# Altium project datapool_8810.PrjPcb (part 1 of 2)
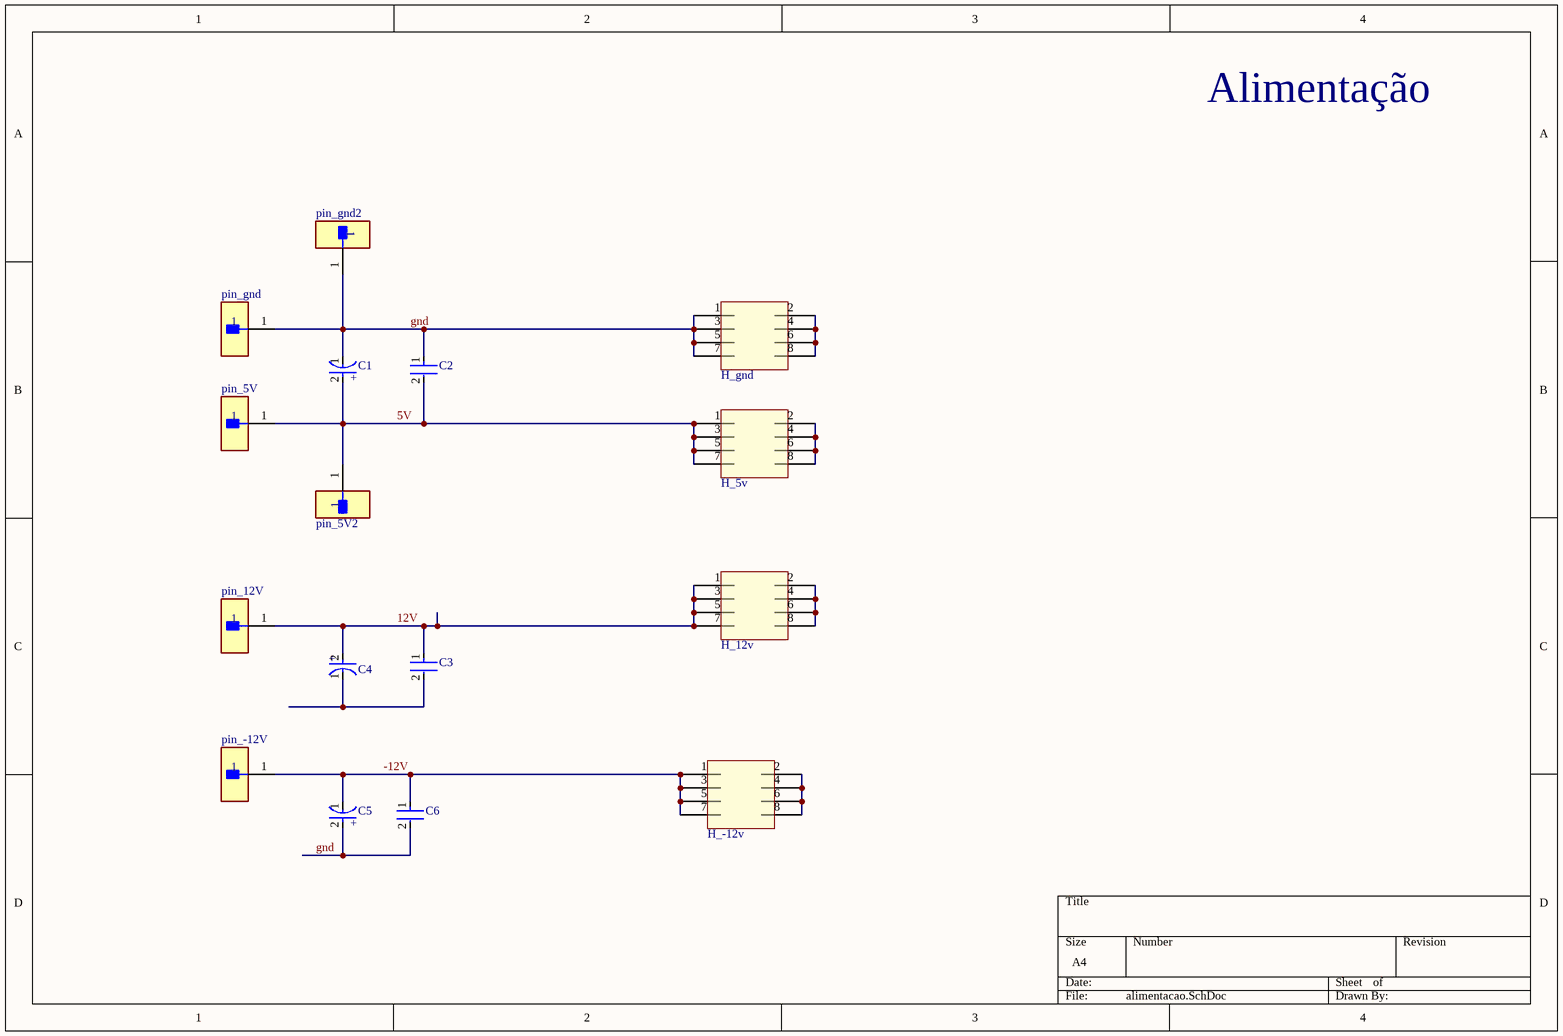
[diagram p0: alimentacao.SchDoc]
7 sheets, 294 parts. Net scope: global (net labels, ports and power ports of the same name join across sheets).
Board file: 8810.PcbDoc
Sheets:
  alimentacao.SchDoc
  protoboard.SchDoc
  leds.SchDoc
  chaves.SchDoc
  clock.SchDoc
  probe.SchDoc
  8810.SchDoc

## Sheet alimentacao.SchDoc
size A4; SheetNumber: 1; SheetTotal: 7

### Parts
(Parts that share a designator on the sheet are numbered #1, #2 ... from top to bottom, then left to right.)
C1#1  EEU-FM1H101BJ  [FP-FM8-MFG]  (value not drawn)
C2#1  RCER71H335K3K1H03B  [FP-RCE3M1-MFG]  (value not drawn)
C3#1  RCER71H335K3K1H03B  [FP-RCE3M1-MFG]  (value not drawn)
C4#1  EEU-FM1H101BJ  [FP-FM8-MFG]  (value not drawn)
C5#1  EEU-FM1H101BJ  [FP-FM8-MFG]  (value not drawn)
C6#1  RCER71H335K3K1H03B  [FP-RCE3M1-MFG]  (value not drawn)
H_5v  header 2x4  [header 2x4]  (value not drawn)
H_12v  header 2x4  [header 2x4]  (value not drawn)
H_-12v  header 2x4  [header 2x4]  (value not drawn)
H_gnd  header 2x4  [header 2x4]  (value not drawn)
pin_5V2#1  TSW-101-07-L-S  [FP-TSW-101-07-L-S-MFG]  (value not drawn)
pin_5V#1  TSW-101-07-L-S  [FP-TSW-101-07-L-S-MFG]  (value not drawn)
pin_12V#1  TSW-101-07-L-S  [FP-TSW-101-07-L-S-MFG]  (value not drawn)
pin_-12V#1  TSW-101-07-L-S  [FP-TSW-101-07-L-S-MFG]  (value not drawn)
pin_gnd2#1  TSW-101-07-L-S  [FP-TSW-101-07-L-S-MFG]  (value not drawn)
pin_gnd#1  TSW-101-07-L-S  [FP-TSW-101-07-L-S-MFG]  (value not drawn)

### Nets
5V: C1#1.2(A) C2#1.2 H_5v.1 H_5v.3 H_5v.5 H_5v.7 pin_5V2#1.1 pin_5V#1.1
12V: C3#1.1 C4#1.2(A) H_12v.1 H_12v.3 H_12v.5 H_12v.7 pin_12V#1.1
-12V: C5#1.1(C) C6#1.1 H_-12v.1 H_-12v.3 H_-12v.5 H_-12v.7 pin_-12V#1.1
gnd: C1#1.1(C) C2#1.1 C5#1.2(A) C6#1.2 H_gnd.1 H_gnd.3 H_gnd.5 H_gnd.7 pin_gnd2#1.1 pin_gnd#1.1
NetC3#1_2: C3#1.2 C4#1.1(C)
NetH_5v_2: H_5v.2 H_5v.4 H_5v.6 H_5v.8
NetH_12v_2: H_12v.2 H_12v.4 H_12v.6 H_12v.8
NetH_-12v_2: H_-12v.2 H_-12v.4 H_-12v.6 H_-12v.8
NetH_gnd_2: H_gnd.2 H_gnd.4 H_gnd.6 H_gnd.8

### Notes on the sheet
- Alimentação
- (in symbol CMP-05427-000021-1) +

### Library data of the parts
C1#1 C4#1 C5#1 = CMP-05427-000021-1: CAP ALUM 10uF 20% 50V RADIAL; Polarity: Polar; Impedance: 61mR; Ripple Current: 870mA; Life (Hours): 3000Hour; Dissipation Factor: 0.1%; Packaging: Ammo Pack; Voltage Rating (DC): 50V; Diameter: 8mm; Radiation Hardening: No; Max Operating Temperature: 105°C; Length: 11.5mm; Tolerance: 20%; Termination: Radial; Features: General Purpose; Case/Package: Radial; Voltage Rating: 50V; Min Operating Temperature: -40°C; Height - Seated (Max): 0.512inch; Mount: Through Hole; Series: FM; Height: 11.5mm; Capacitance: 10uF; ESR (Equivalent Series Resistance): 61mR; Lead Free: Lead Free; Lead Pitch: 0.197inch; Package Quantity: 1000
C2#1 C3#1 C6#1 = CMP-06035-028451-1: Cap Ceramic 100nF 50V X7R ±10% Radial 5mm +125°C Automotive Ammo Pack; Lead Diameter: 0.5mm; Lead/Base Style: Formed Leads; Height: 5mm; Ratings: AEC-Q200; Capacitance: 100nF; Package Quantity: 500; Length: 0.217inch; Min Operating Temperature: -55°C; Voltage Rating (DC): 50V; Dielectric: X7R; Case/Package: Radial; Height - Seated (Max): 0.197inch; Termination: Radial; Mount: Through Hole; Max Operating Temperature: 125°C; Width: 0.157inch; Voltage Rating: 50V; Packaging: Bulk; Resistor Type: Ceramic; Tolerance: 10%; Lead Pitch: 0.197inch
H_5v H_12v H_-12v H_gnd = header 2x4: header male 2x4; pin to pad: 1>C1 2>C2 3>C3 4>C4 5>C5 6>C6 7>C7 8>C8; Parameter 1: header 2x4
pin_5V2#1 pin_5V#1 pin_12V#1 pin_-12V#1 pin_gnd2#1 pin_gnd#1 = CMP-02766-001775-1: CONN HEADER VERT 1POS; Gender: Male; Number of Contacts: 1; Max Current Rating: 7.6A; Max Voltage Rating (AC): 550V; RoHS Compliant: Yes; Contact Finish - Mating: GOLD; Length: 2.54mm; Series: TSW; Insulation Material: PBT; Reach SVHC Compliant: Yes; Radiation Hardening: No; Contact Plating: Gold; Termination: Solder; Contact Type: Male Pin; Orientation: Straight; Number of Rows: 1; Depth: 2.54mm; Housing Material: Polyester; Lead Free: Lead Free; Fastening Type: Pull; Flammability Rating: UL94 V-0; Mount: Through Hole; Housing Color: Black; Contact Shape: Square; Min Operating Temperature: -55°C; Connector Type: Header; Contact Mating Length: 0.23inch; Width: 2.54mm; Packaging: Bulk; Contact Material: Bronze; Max Operating Temperature: 125°C; Number of Positions: 1; Color: Black; Insulation Color: Black

## Sheet protoboard.SchDoc
size A4; SheetNumber: 2; SheetTotal: 7
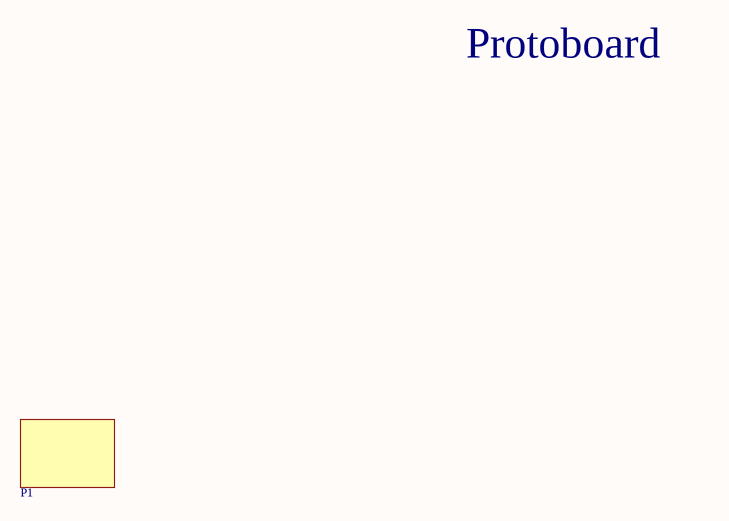
[diagram p1: protoboard.SchDoc]

### Parts
P1  2 protoboard 830 pin  [PCBComponent_1]  (value not drawn)

### Notes on the sheet
- Protoboard

### Library data of the parts
P1 = protoboard: 2 protoboard 830 pin  each; Parameter 1: 2X830 pin

## Sheet leds.SchDoc
size A3 portrait; SheetNumber: 2; SheetTotal: 6
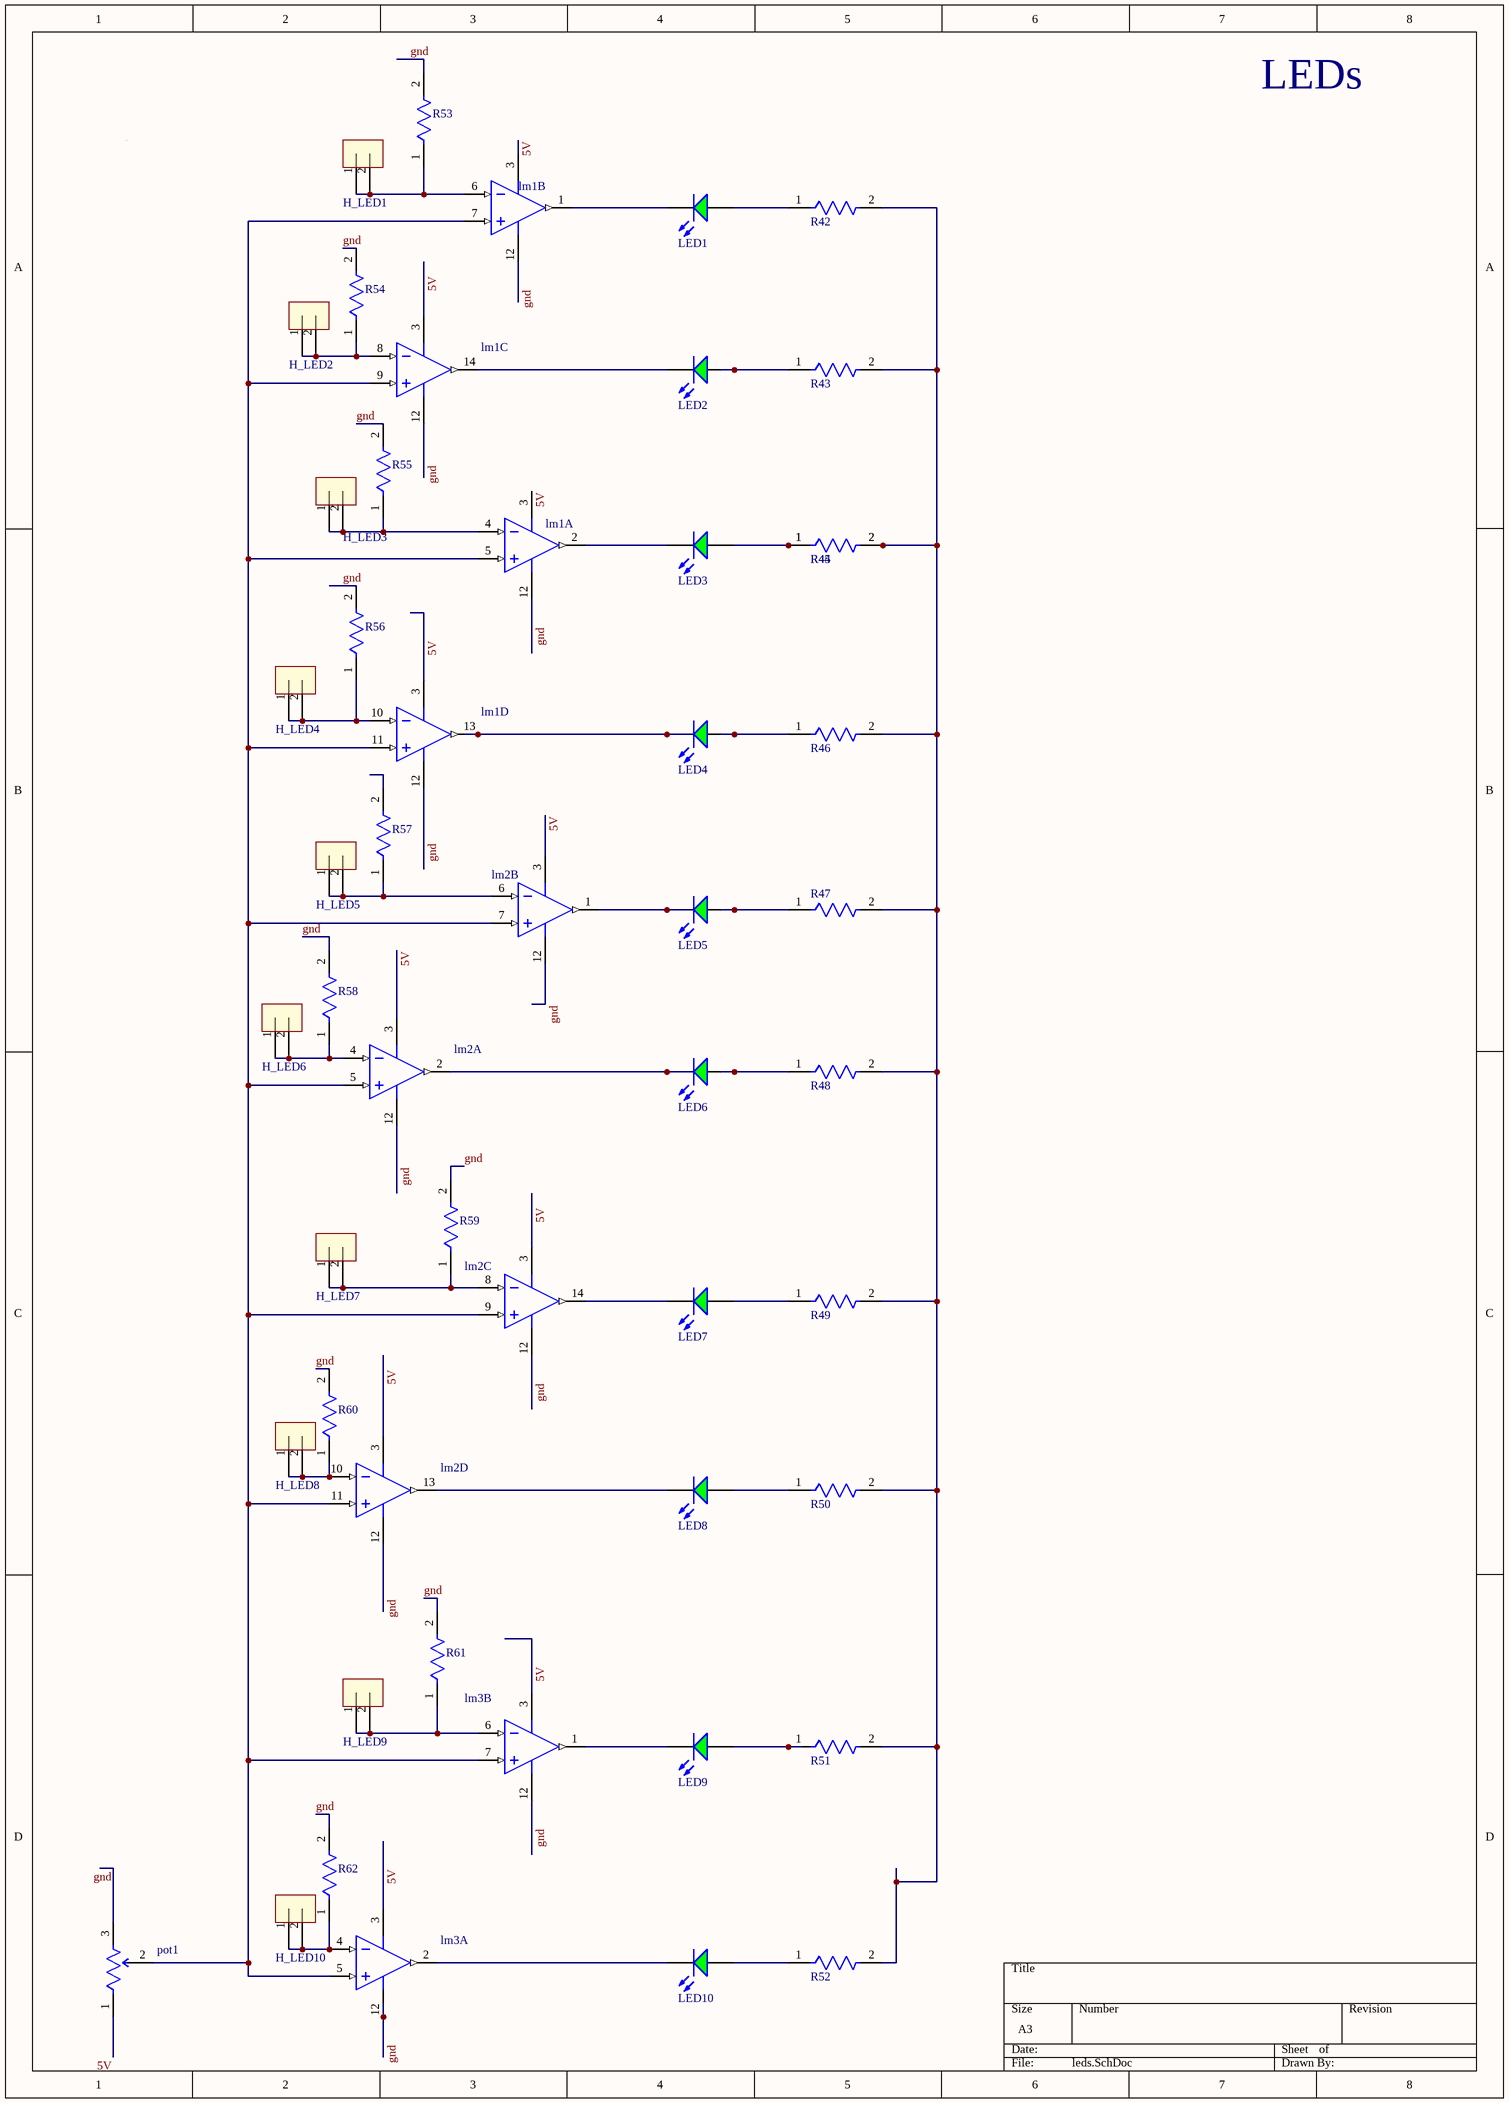
[diagram p2: leds.SchDoc]

### Parts
(Parts that share a designator on the sheet are numbered #1, #2 ... from top to bottom, then left to right.)
H_LED1  header 2x1  [header 2x1]  (value not drawn)
H_LED2  header 2x1  [header 2x1]  (value not drawn)
H_LED3  header 2x1  [header 2x1]  (value not drawn)
H_LED4  header 2x1  [header 2x1]  (value not drawn)
H_LED5  header 2x1  [header 2x1]  (value not drawn)
H_LED6  header 2x1  [header 2x1]  (value not drawn)
H_LED7  header 2x1  [header 2x1]  (value not drawn)
H_LED8  header 2x1  [header 2x1]  (value not drawn)
H_LED9  header 2x1  [header 2x1]  (value not drawn)
H_LED10  header 2x1  [header 2x1]  (value not drawn)
LED1#1  WP7113SGD  [KING-WP7113SGD_V]  (value not drawn)
LED2#1  WP7113SGD  [KING-WP7113SGD_V]  (value not drawn)
LED3#1  WP7113SGD  [KING-WP7113SGD_V]  (value not drawn)
LED4#1  WP7113SGD  [KING-WP7113SGD_V]  (value not drawn)
LED5#1  WP7113SGD  [KING-WP7113SGD_V]  (value not drawn)
LED6#1  WP7113SGD  [KING-WP7113SGD_V]  (value not drawn)
LED7#1  WP7113SGD  [KING-WP7113SGD_V]  (value not drawn)
LED8#1  WP7113SGD  [KING-WP7113SGD_V]  (value not drawn)
LED9#1  WP7113SGD  [KING-WP7113SGD_V]  (value not drawn)
LED10#1  WP7113SGD  [KING-WP7113SGD_V]  (value not drawn)
lm1#1  LM339J  [J0014A]  (value not drawn)  (parts A,B,C,D of 4)
lm2#1  LM339J  [J0014A]  (value not drawn)  (parts A,B,C,D of 4)
lm3#1  LM339J  [J0014A]  (value not drawn)  (parts A,B of 4)
pot1#1  3296W-1-501LF  [FP-3296W-MFG]  (value not drawn)
R42#1  MRS16000C2002FCT00  [FP-MRS1600-MFG]  (value not drawn)
R43#1  MRS16000C2002FCT00  [FP-MRS1600-MFG]  (value not drawn)
R44#1  MRS16000C2002FCT00  [FP-MRS1600-MFG]  (value not drawn)
R45#1  MRS16000C2002FCT00  [FP-MRS1600-MFG]  (value not drawn)
R46#1  MRS16000C2002FCT00  [FP-MRS1600-MFG]  (value not drawn)
R47#1  MRS16000C2002FCT00  [FP-MRS1600-MFG]  (value not drawn)
R48#1  MRS16000C2002FCT00  [FP-MRS1600-MFG]  (value not drawn)
R49#1  MRS16000C2002FCT00  [FP-MRS1600-MFG]  (value not drawn)
R50#1  MRS16000C2002FCT00  [FP-MRS1600-MFG]  (value not drawn)
R51#1  MRS16000C2002FCT00  [FP-MRS1600-MFG]  (value not drawn)
R52#1  MRS16000C2002FCT00  [FP-MRS1600-MFG]  (value not drawn)
R53#1  MRS16000C2002FCT00  [FP-MRS1600-MFG]  (value not drawn)
R54#1  MRS16000C2002FCT00  [FP-MRS1600-MFG]  (value not drawn)
R55#1  MRS16000C2002FCT00  [FP-MRS1600-MFG]  (value not drawn)
R56#1  MRS16000C2002FCT00  [FP-MRS1600-MFG]  (value not drawn)
R57#1  MRS16000C2002FCT00  [FP-MRS1600-MFG]  (value not drawn)
R58#1  MRS16000C2002FCT00  [FP-MRS1600-MFG]  (value not drawn)
R59  MRS16000C2002FCT00  [FP-MRS1600-MFG]  (value not drawn)
R60  MRS16000C2002FCT00  [FP-MRS1600-MFG]  (value not drawn)
R61  MRS16000C2002FCT00  [FP-MRS1600-MFG]  (value not drawn)
R62  MRS16000C2002FCT00  [FP-MRS1600-MFG]  (value not drawn)

### Nets
5V: lm1#1.3(V+) lm2#1.3(V+) lm3#1.3(V+) pot1#1.1(CCW)
gnd: lm1#1.12(GND) lm2#1.12(GND) lm3#1.12(GND) pot1#1.3(CW) R53#1.2 R54#1.2 R55#1.2 R56#1.2 R58#1.2 R59.2 R60.2 R61.2 R62.2
NetH_LED1_1: H_LED1.1 H_LED1.2 lm1#1.6(IN2-) R53#1.1
NetH_LED2_1: H_LED2.1 H_LED2.2 lm1#1.8(IN3-) R54#1.1
NetH_LED3_1: H_LED3.1 H_LED3.2 lm1#1.4(IN1-) R55#1.1
NetH_LED4_1: H_LED4.1 H_LED4.2 lm1#1.10(IN4-) R56#1.1
NetH_LED5_1: H_LED5.1 H_LED5.2 lm2#1.6(IN2-) R57#1.1
NetH_LED6_1: H_LED6.1 H_LED6.2 lm2#1.4(IN1-) R58#1.1
NetH_LED7_1: H_LED7.1 H_LED7.2 lm2#1.8(IN3-) R59.1
NetH_LED8_1: H_LED8.1 H_LED8.2 lm2#1.10(IN4-) R60.1
NetH_LED9_1: H_LED9.1 H_LED9.2 lm3#1.6(IN2-) R61.1
NetH_LED10_1: H_LED10.1 H_LED10.2 lm3#1.4(IN1-) R62.1
NetLED1#1_1: LED1#1.1(A) R42#1.1
NetLED1#1_2: LED1#1.2(K) lm1#1.1(OUT2)
NetLED2#1_1: LED2#1.1(A) R43#1.1
NetLED2#1_2: LED2#1.2(K) lm1#1.14(OUT3)
NetLED3#1_1: LED3#1.1(A) R44#1.1 R45#1.1
NetLED3#1_2: LED3#1.2(K) lm1#1.2(OUT1)
NetLED4#1_1: LED4#1.1(A) R46#1.1
NetLED4#1_2: LED4#1.2(K) lm1#1.13(OUT4)
NetLED5#1_1: LED5#1.1(A) R47#1.1
NetLED5#1_2: LED5#1.2(K) lm2#1.1(OUT2)
NetLED6#1_1: LED6#1.1(A) R48#1.1
NetLED6#1_2: LED6#1.2(K) lm2#1.2(OUT1)
NetLED7#1_1: LED7#1.1(A) R49#1.1
NetLED7#1_2: LED7#1.2(K) lm2#1.14(OUT3)
NetLED8#1_1: LED8#1.1(A) R50#1.1
NetLED8#1_2: LED8#1.2(K) lm2#1.13(OUT4)
NetLED9#1_1: LED9#1.1(A) R51#1.1
NetLED9#1_2: LED9#1.2(K) lm3#1.1(OUT2)
NetLED10#1_1: LED10#1.1(A) R52#1.1
NetLED10#1_2: LED10#1.2(K) lm3#1.2(OUT1)
Netlm1#1_5: lm1#1.5(IN1+) lm1#1.7(IN2+) lm1#1.9(IN3+) lm1#1.11(IN4+) lm2#1.5(IN1+) lm2#1.7(IN2+) lm2#1.9(IN3+) lm2#1.11(IN4+) lm3#1.5(IN1+) lm3#1.7(IN2+) pot1#1.2(WIPER)
NetR42#1_2: R42#1.2 R43#1.2 R44#1.2 R45#1.2 R46#1.2 R47#1.2 R48#1.2 R49#1.2 R50#1.2 R51#1.2 R52#1.2

Not connected (* = marked no-connect by the designer): R57#1 2

### Notes on the sheet
- LEDs

### Library data of the parts
H_LED1-H_LED10 = Heade 1x2: header male 2 pin; pin to pad: 1>C1 2>C2; Parameter 1: H2x1; Parameter 2: *
LED1#1 LED2#1 LED3#1 LED4#1 LED5#1 LED6#1 LED7#1 LED8#1 LED9#1 LED10#1 = CMP-2100-03698-1: LED Green, 62.5 mW, 25 mA, -40 to 85 degC, 2-Pin THD, RoHS, Bulk; Manufacturer: Kingbright; Viewing Angle: 30degrees; Lens Style: Tinted; Test Current: 20mA; Forward Voltage: 2.2V; Wavelength: 568nm; Luminous Intensity: 40mcd; Package Reference: WP7113SGD; Colour: Green; Lead Free: LeadFree; Packaging: Bulk; RoHSCompliant: true; Package Quantity: 1000; Illumination Colour: Green; Case/Package: Radial; Datasheet URL: http://www.kingbrightusa.com/images/catalog/SPEC/WP7113SGD.pdf; Dominant Wavelength: 568nm; Datasheet Version: Rev. 6B, 01/2015; Package Description: 2-Pin Through Hole Device, Dia 5.9 mm, Body Length 8.6 mm; Height: 8.6mm
lm1#1 lm2#1 lm3#1 = CMP-0060-00012-3: Low Power Low Offset Voltage Quad Comparator, 14-pin CerDIP; Manufacturer: Texas Instruments; PowerWise: N; PackageTopMarking: NSUZXYYTT*LM339J; PackageDescription: Cerdip, .400 x .310in Body, 14 Lead, .300in Centers, .100in Pitch; ComponentLink1Description: Datasheet URL; PinCount: 14; PackageReference: J0014A; ComponentLink1URL: http://www.ti.com/general/docs/lit/getliterature.tsp?genericPartNumber=LM339-N&fileType=pdf; CompType: Comparator; RoHS: N
pot1#1 = CMP-07234-000046-1: TRIMMER 500 OHM 0.5W PC PIN TOP; Resistance: 10kR; Temperature Coefficient: 100ppm/°C; Resistance Tolerance: 10%; Number of Turns: 25; Max Power Dissipation: 500mW; Packaging: Rail/Tube; Color: Blue; Technology: CERMET; Max Operating Temperature: 125°C; RoHS Compliant: Yes; Radiation Hardening: No; Series: 3296; Military Standard: Not; Width: 9.53mm; Weight: 0.03oz; Length: 9.53mm; Package Quantity: 50; Height: 0.395inch; Min Operating Temperature: -55°C; Lead Free: Lead Free; Mount: Through Hole; Depth: 4.83mm; Termination: Pin; Taper: Linear; Contact Plating: Tin; Resistor Type: Cermet; Tolerance: 10%; REACH SVHC: No SVHC; Power Rating: 500mW
R42#1 R43#1 R44#1 R45#1 R46#1 R47#1 R48#1 R49#1 R50#1 R51#1 R52#1 R53#1 R54#1 R55#1 R56#1 R57#1 R58#1 R59-R62 = CMP-02408-000019-1: RES 20K OHM 0.4W 1% AXIAL; Max Power Dissipation: 400mW; Temperature Coefficient: 50ppm/°C; Resistance: 20kR; Technology: THIN FILM; Max Operating Temperature: 155°C; Number of Terminations: 2; RoHS Compliant: Yes; Packaging: Tape and Reel; Radiation Hardening: No; Contact Plating: Tin; Military Standard: Not; Construction: Cylindrical; Diameter: 1.6mm; Tolerance: 1%; Mount: Through Hole; Power Rating: 400mW; Case/Package: Conformal; Termination: Axial; Length: 3.6mm; Min Operating Temperature: -55°C; Resistor Type: Metal Film; Series: MRS16

## Sheet chaves.SchDoc
size A3 portrait; SheetNumber: 3; SheetTotal: 6
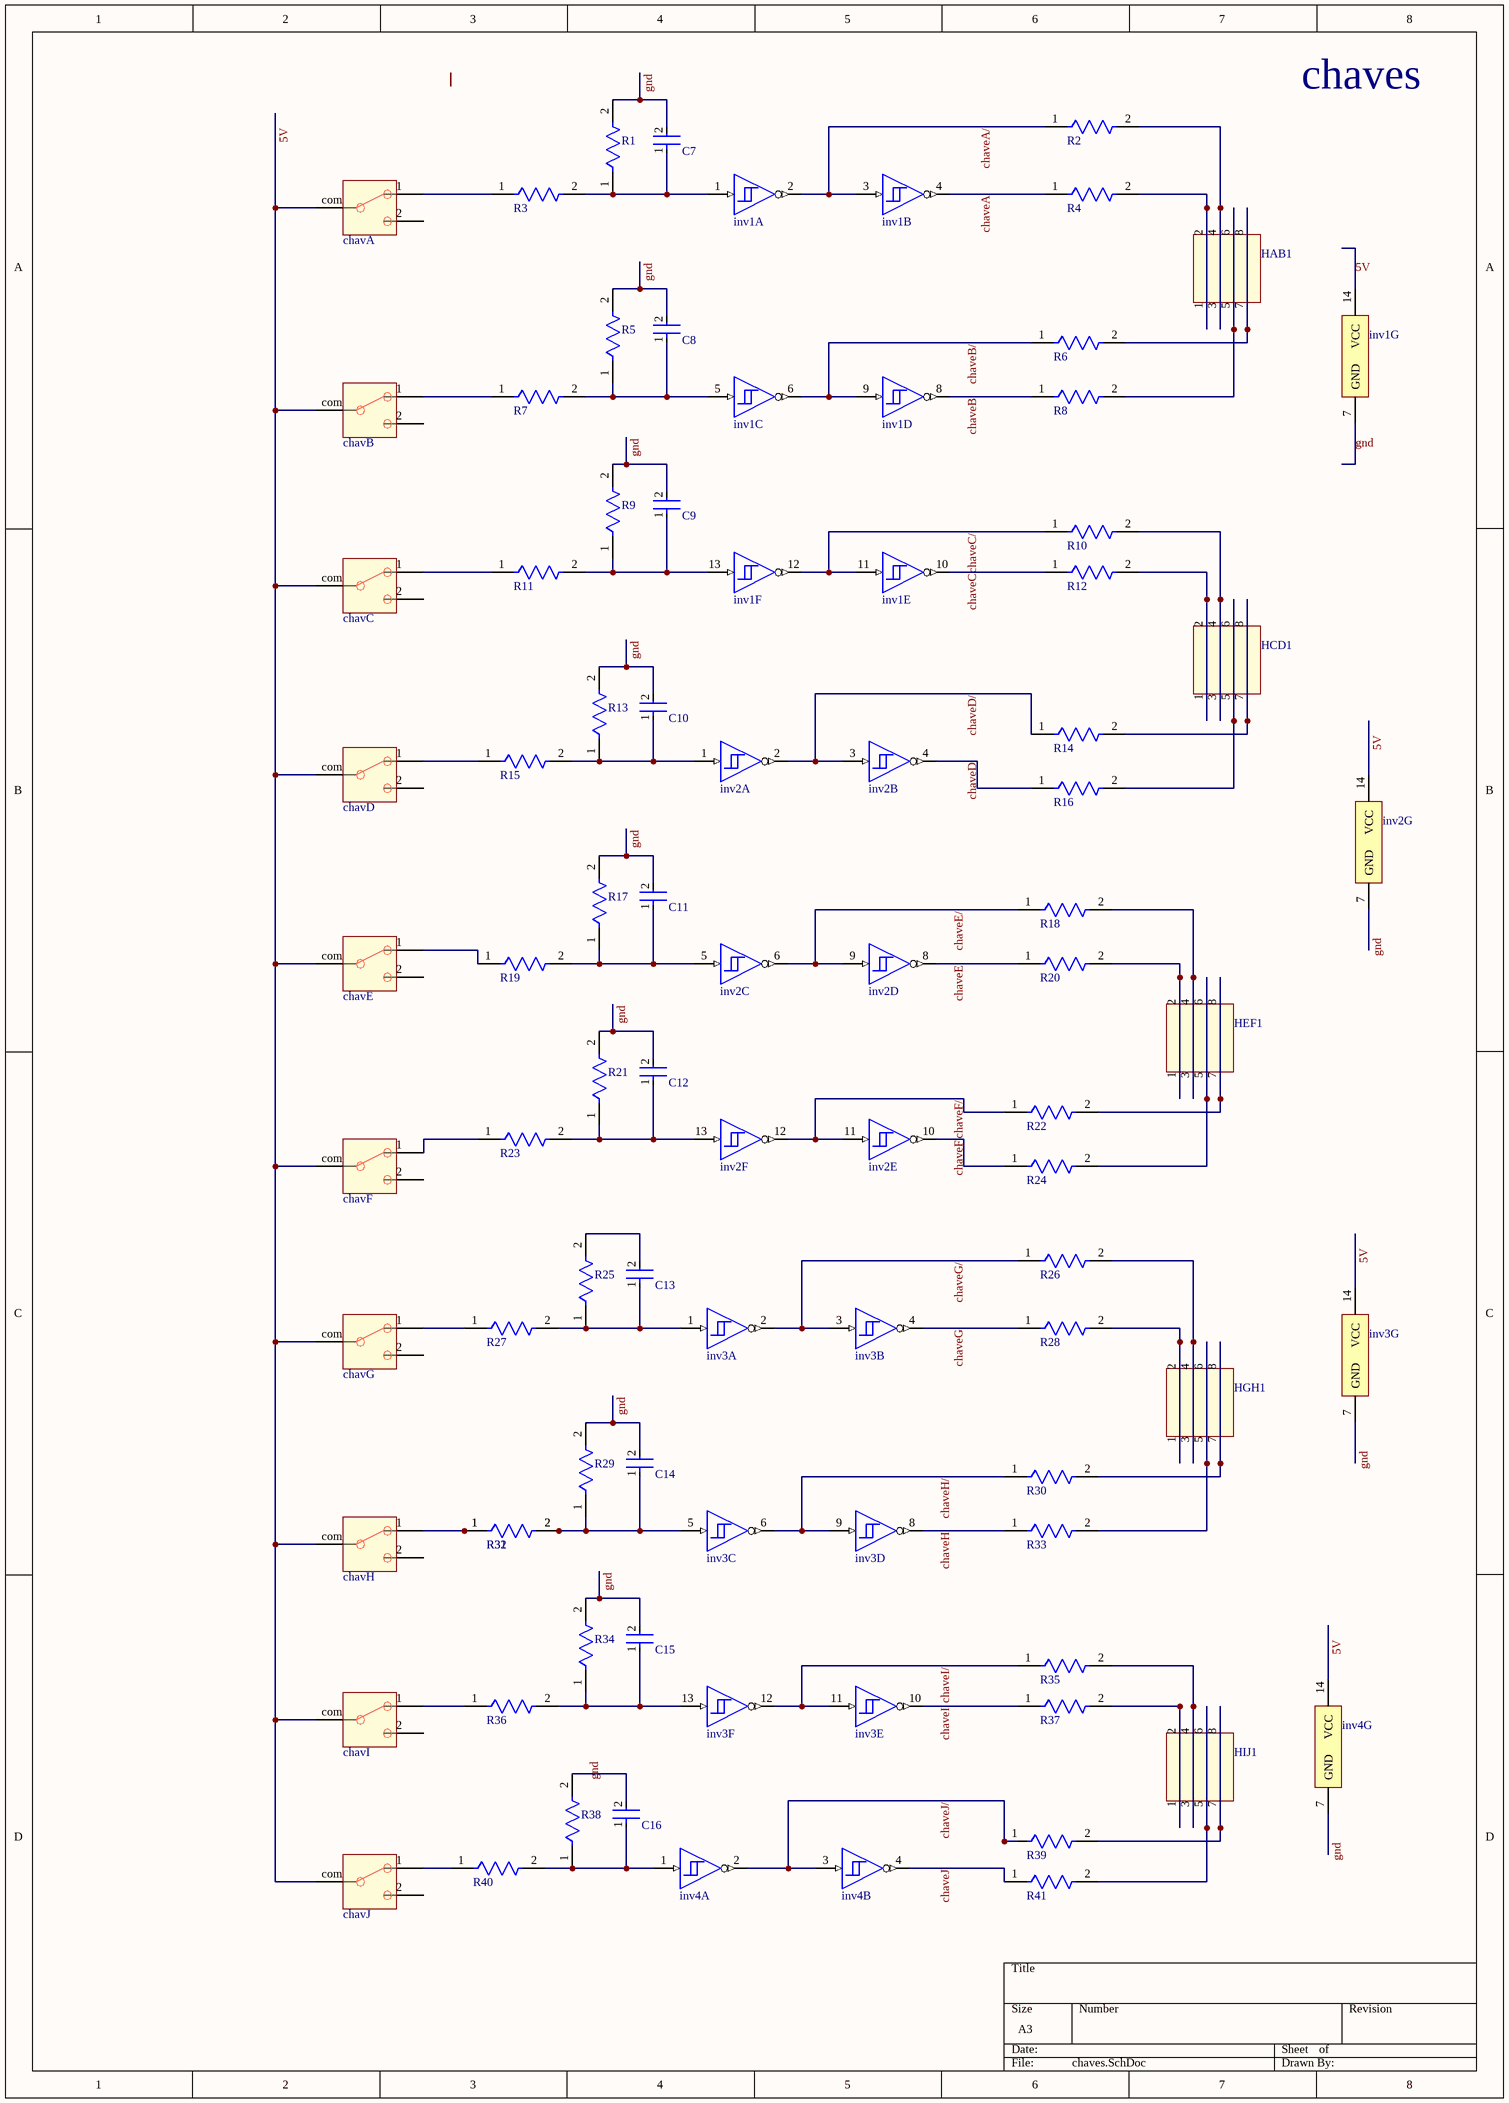
[diagram p3: chaves.SchDoc]

### Parts
(Parts that share a designator on the sheet are numbered #1, #2 ... from top to bottom, then left to right.)
C7#1  RCER71H335K3K1H03B  [FP-RCE3M1-MFG]  (value not drawn)
C8#1  RCER71H335K3K1H03B  [FP-RCE3M1-MFG]  (value not drawn)
C9#1  RCER71H335K3K1H03B  [FP-RCE3M1-MFG]  (value not drawn)
C10#1  RCER71H335K3K1H03B  [FP-RCE3M1-MFG]  (value not drawn)
C11#1  RCER71H335K3K1H03B  [FP-RCE3M1-MFG]  (value not drawn)
C12  RCER71H335K3K1H03B  [FP-RCE3M1-MFG]  (value not drawn)
C13  RCER71H335K3K1H03B  [FP-RCE3M1-MFG]  (value not drawn)
C14  RCER71H335K3K1H03B  [FP-RCE3M1-MFG]  (value not drawn)
C15  RCER71H335K3K1H03B  [FP-RCE3M1-MFG]  (value not drawn)
C16  RCER71H335K3K1H03B  [FP-RCE3M1-MFG]  (value not drawn)
chavA  chave MTS-102  [MTS-102]  (value not drawn)
chavB  chave MTS-102  [MTS-102]  (value not drawn)
chavC  chave MTS-102  [MTS-102]  (value not drawn)
chavD  chave MTS-102  [MTS-102]  (value not drawn)
chavE  chave MTS-102  [MTS-102]  (value not drawn)
chavF  chave MTS-102  [MTS-102]  (value not drawn)
chavG  chave MTS-102  [MTS-102]  (value not drawn)
chavH  chave MTS-102  [MTS-102]  (value not drawn)
chavI  chave MTS-102  [MTS-102]  (value not drawn)
chavJ  chave MTS-102  [MTS-102]  (value not drawn)
HAB1  header 2x4  [header 2x4]  (value not drawn)
HCD1  header 2x4  [header 2x4]  (value not drawn)
HEF1  header 2x4  [header 2x4]  (value not drawn)
HGH1  header 2x4  [header 2x4]  (value not drawn)
HIJ1  header 2x4  [header 2x4]  (value not drawn)
inv1#1  SN74HC14N  [N0014A]  (value not drawn)  (parts A,B,C,D,E,F,G of 7)
inv2#1  SN74HC14N  [N0014A]  (value not drawn)  (parts A,B,C,D,E,F,G of 7)
inv3#1  SN74HC14N  [N0014A]  (value not drawn)  (parts A,B,C,D,E,F,G of 7)
inv4#1  SN74HC14N  [N0014A]  (value not drawn)  (parts A,B,G of 7)
R1#1  MRS16000C2002FCT00  [FP-MRS1600-MFG]  (value not drawn)
R2#1  MRS16000C2002FCT00  [FP-MRS1600-MFG]  (value not drawn)
R3#1  MRS16000C2002FCT00  [FP-MRS1600-MFG]  (value not drawn)
R4#1  MRS16000C2002FCT00  [FP-MRS1600-MFG]  (value not drawn)
R5#1  MRS16000C2002FCT00  [FP-MRS1600-MFG]  (value not drawn)
R6#1  MRS16000C2002FCT00  [FP-MRS1600-MFG]  (value not drawn)
R7#1  MRS16000C2002FCT00  [FP-MRS1600-MFG]  (value not drawn)
R8#1  MRS16000C2002FCT00  [FP-MRS1600-MFG]  (value not drawn)
R9#1  MRS16000C2002FCT00  [FP-MRS1600-MFG]  (value not drawn)
R10#1  MRS16000C2002FCT00  [FP-MRS1600-MFG]  (value not drawn)
R11#1  MRS16000C2002FCT00  [FP-MRS1600-MFG]  (value not drawn)
R12#1  MRS16000C2002FCT00  [FP-MRS1600-MFG]  (value not drawn)
R13#1  MRS16000C2002FCT00  [FP-MRS1600-MFG]  (value not drawn)
R14#1  MRS16000C2002FCT00  [FP-MRS1600-MFG]  (value not drawn)
R15#1  MRS16000C2002FCT00  [FP-MRS1600-MFG]  (value not drawn)
R16#1  MRS16000C2002FCT00  [FP-MRS1600-MFG]  (value not drawn)
R17#1  MRS16000C2002FCT00  [FP-MRS1600-MFG]  (value not drawn)
R18  MRS16000C2002FCT00  [FP-MRS1600-MFG]  (value not drawn)
R19  MRS16000C2002FCT00  [FP-MRS1600-MFG]  (value not drawn)
R20#1  MRS16000C2002FCT00  [FP-MRS1600-MFG]  (value not drawn)
R21#1  MRS16000C2002FCT00  [FP-MRS1600-MFG]  (value not drawn)
R22#1  MRS16000C2002FCT00  [FP-MRS1600-MFG]  (value not drawn)
R23#1  MRS16000C2002FCT00  [FP-MRS1600-MFG]  (value not drawn)
R24#1  MRS16000C2002FCT00  [FP-MRS1600-MFG]  (value not drawn)
R25#1  MRS16000C2002FCT00  [FP-MRS1600-MFG]  (value not drawn)
R26#1  MRS16000C2002FCT00  [FP-MRS1600-MFG]  (value not drawn)
R27#1  MRS16000C2002FCT00  [FP-MRS1600-MFG]  (value not drawn)
R28#1  MRS16000C2002FCT00  [FP-MRS1600-MFG]  (value not drawn)
R29#1  MRS16000C2002FCT00  [FP-MRS1600-MFG]  (value not drawn)
R30#1  MRS16000C2002FCT00  [FP-MRS1600-MFG]  (value not drawn)
R31#1  MRS16000C2002FCT00  [FP-MRS1600-MFG]  (value not drawn)
R32#1  MRS16000C2002FCT00  [FP-MRS1600-MFG]  (value not drawn)
R33#1  MRS16000C2002FCT00  [FP-MRS1600-MFG]  (value not drawn)
R34#1  MRS16000C2002FCT00  [FP-MRS1600-MFG]  (value not drawn)
R35#1  MRS16000C2002FCT00  [FP-MRS1600-MFG]  (value not drawn)
R36#1  MRS16000C2002FCT00  [FP-MRS1600-MFG]  (value not drawn)
R37#1  MRS16000C2002FCT00  [FP-MRS1600-MFG]  (value not drawn)
R38#1  MRS16000C2002FCT00  [FP-MRS1600-MFG]  (value not drawn)
R39#1  MRS16000C2002FCT00  [FP-MRS1600-MFG]  (value not drawn)
R40#1  MRS16000C2002FCT00  [FP-MRS1600-MFG]  (value not drawn)
R41#1  MRS16000C2002FCT00  [FP-MRS1600-MFG]  (value not drawn)

### Nets
5V: chavA.com chavB.com chavC.com chavD.com chavE.com chavF.com chavG.com chavH.com chavI.com chavJ.com inv1#1.14(VCC) inv2#1.14(VCC) inv3#1.14(VCC) inv4#1.14(VCC)
chaveA: inv1#1.4(~{2Y}) R4#1.1
chaveA/: inv1#1.2(~{1Y}) inv1#1.3(2A) R2#1.1
chaveB: inv1#1.8(~{4Y}) R8#1.1
chaveB/: inv1#1.6(~{3Y}) inv1#1.9(4A) R6#1.1
chaveC: inv1#1.10(~{5Y}) R12#1.1
chaveC/: inv1#1.11(5A) inv1#1.12(~{6Y}) R10#1.1
chaveD: inv2#1.4(~{2Y}) R16#1.1
chaveD/: inv2#1.2(~{1Y}) inv2#1.3(2A) R14#1.1
chaveE: inv2#1.8(~{4Y}) R20#1.1
chaveE/: inv2#1.6(~{3Y}) inv2#1.9(4A) R18.1
chaveF: inv2#1.10(~{5Y}) R24#1.1
chaveF/: inv2#1.11(5A) inv2#1.12(~{6Y}) R22#1.1
chaveG: inv3#1.4(~{2Y}) R28#1.1
chaveG/: inv3#1.2(~{1Y}) inv3#1.3(2A) R26#1.1
chaveH: inv3#1.8(~{4Y}) R33#1.1
chaveH/: inv3#1.6(~{3Y}) inv3#1.9(4A) R30#1.1
chaveI: inv3#1.10(~{5Y}) R37#1.1
chaveI/: inv3#1.11(5A) inv3#1.12(~{6Y}) R35#1.1
chaveJ: inv4#1.4(~{2Y}) R41#1.1
chaveJ/: inv4#1.2(~{1Y}) inv4#1.3(2A) R39#1.1
gnd: C7#1.2 C8#1.2 C9#1.2 C10#1.2 C11#1.2 C12.2 C14.2 C15.2 inv1#1.7(GND) inv2#1.7(GND) inv3#1.7(GND) inv4#1.7(GND) R1#1.2 R5#1.2 R9#1.2 R13#1.2 R17#1.2 R21#1.2 R29#1.2 R34#1.2
NetC7#1_1: C7#1.1 inv1#1.1(1A) R1#1.1 R3#1.2
NetC8#1_1: C8#1.1 inv1#1.5(3A) R5#1.1 R7#1.2
NetC9#1_1: C9#1.1 inv1#1.13(6A) R9#1.1 R11#1.2
NetC10#1_1: C10#1.1 inv2#1.1(1A) R13#1.1 R15#1.2
NetC11#1_1: C11#1.1 inv2#1.5(3A) R17#1.1 R19.2
NetC12_1: C12.1 inv2#1.13(6A) R21#1.1 R23#1.2
NetC13_1: C13.1 inv3#1.1(1A) R25#1.1 R27#1.2
NetC13_2: C13.2 R25#1.2
NetC14_1: C14.1 inv3#1.5(3A) R29#1.1 R31#1.2 R32#1.2
NetC15_1: C15.1 inv3#1.13(6A) R34#1.1 R36#1.2
NetC16_1: C16.1 inv4#1.1(1A) R38#1.1 R40#1.2
NetC16_2: C16.2 R38#1.2
NetchavA_1: chavA.1 R3#1.1
NetchavB_1: chavB.1 R7#1.1
NetchavC_1: chavC.1 R11#1.1
NetchavD_1: chavD.1 R15#1.1
NetchavE_1: chavE.1 R19.1
NetchavF_1: chavF.1 R23#1.1
NetchavG_1: chavG.1 R27#1.1
NetchavH_1: chavH.1 R31#1.1 R32#1.1
NetchavI_1: chavI.1 R36#1.1
NetchavJ_1: chavJ.1 R40#1.1
NetHAB1_1: HAB1.1 HAB1.2 R4#1.2
NetHAB1_3: HAB1.3 HAB1.4 R2#1.2
NetHAB1_5: HAB1.5 HAB1.6 R8#1.2
NetHAB1_7: HAB1.7 HAB1.8 R6#1.2
NetHCD1_1: HCD1.1 HCD1.2 R12#1.2
NetHCD1_3: HCD1.3 HCD1.4 R10#1.2
NetHCD1_5: HCD1.5 HCD1.6 R16#1.2
NetHCD1_7: HCD1.7 HCD1.8 R14#1.2
NetHEF1_1: HEF1.1 HEF1.2 R20#1.2
NetHEF1_3: HEF1.3 HEF1.4 R18.2
NetHEF1_5: HEF1.5 HEF1.6 R24#1.2
NetHEF1_7: HEF1.7 HEF1.8 R22#1.2
NetHGH1_1: HGH1.1 HGH1.2 R28#1.2
NetHGH1_3: HGH1.3 HGH1.4 R26#1.2
NetHGH1_5: HGH1.5 HGH1.6 R33#1.2
NetHGH1_7: HGH1.7 HGH1.8 R30#1.2
NetHIJ1_1: HIJ1.1 HIJ1.2 R37#1.2
NetHIJ1_3: HIJ1.3 HIJ1.4 R35#1.2
NetHIJ1_5: HIJ1.5 HIJ1.6 R41#1.2
NetHIJ1_7: HIJ1.7 HIJ1.8 R39#1.2

Not connected (* = marked no-connect by the designer): chavA 2; chavB 2; chavC 2; chavD 2; chavE 2; chavF 2; chavG 2; chavH 2; chavI 2; chavJ 2

### Notes on the sheet
- chaves
- Labels drawn without touching a wire or pin: gnd

### Library data of the parts
C7#1 C8#1 C9#1 C10#1 C11#1 C12 = CMP-06035-028451-1: Cap Ceramic 3.3uF 50V X7R ±10% Radial 5mm +125°C Automotive Ammo Pack; Capacitance: 100nF; Lead Diameter: 0.5mm; Lead/Base Style: Formed Leads; Height: 5mm; Ratings: AEC-Q200; Package Quantity: 500; Length: 0.217inch; Min Operating Temperature: -55°C; Voltage Rating (DC): 50V; Dielectric: X7R; Case/Package: Radial; Height - Seated (Max): 0.197inch; Termination: Radial; Mount: Through Hole; Max Operating Temperature: 125°C; Width: 0.157inch; Voltage Rating: 50V; Packaging: Bulk; Resistor Type: Ceramic; Tolerance: 10%; Lead Pitch: 0.197inch
C13-C16 = CMP-06035-028451-1: Cap Ceramic 3.3uF 50V X7R ±10% Radial 5mm +125°C Automotive Ammo Pack; Lead Diameter: 0.5mm; Lead/Base Style: Formed Leads; Height: 5mm; Ratings: AEC-Q200; Capacitance: 3.3uF; Package Quantity: 500; Length: 0.217inch; Min Operating Temperature: -55°C; Voltage Rating (DC): 50V; Dielectric: X7R; Case/Package: Radial; Height - Seated (Max): 0.197inch; Termination: Radial; Mount: Through Hole; Max Operating Temperature: 125°C; Width: 0.157inch; Voltage Rating: 50V; Packaging: Bulk; Resistor Type: Ceramic; Tolerance: 10%; Lead Pitch: 0.197inch
chavA chavB chavC chavD chavE chavF chavG chavH chavI chavJ = MTS-102: chave caso seja usadsada sendo encaixada; Parameter 1: MTS-102
HAB1 HCD1 HEF1 HGH1 HIJ1 = header 2x4: header male 2x4; pin to pad: 1>C1 2>C2 3>C3 4>C4 5>C5 6>C6 7>C7 8>C8; Parameter 1: header 2x4
inv1#1 inv2#1 inv3#1 inv4#1 = CMP-1615-00889-3: Hex Schmitt-Trigger Inverters, N0014A, TUBE; Manufacturer: Texas Instruments; Input Type: CMOS; Voltage(Nom)(V): 5; VCC(Min)(V): 2; tpd @ Nom Voltage(Max)(ns): 31; Technology Family: HC; VCC(Max)(V): 6; F @ Nom Voltage(Max)(Mhz): 20; Output Drive (IOL/IOH)(Max)(mA): -4/4; Rating: Catalog; Schmitt Trigger: Yes; ICC @ Nom Voltage(Max)(mA): 0.02; PackageReference: N0014A; Code_JEDEC: MS-001; Operating Temperature Range(C): -40 to 85; Generic Part Number: SN74HC14; Bits(#): 6; DatasheetVersion: SCLS085G; Output Type: CMOS
R1#1 R5#1 R9#1 R13#1 R17#1 R21#1 R25#1 R29#1 R32#1 R34#1 R38#1 = CMP-02408-000019-1: as R42#1 on sheet leds; Technology: THIN FILM; Max Operating Temperature: 155°C; Number of Terminations: 2; RoHS Compliant: Yes; Packaging: Tape and Reel; Radiation Hardening: No; Contact Plating: Tin; Military Standard: Not; Construction: Cylindrical; Diameter: 1.6mm; Tolerance: 1%; Mount: Through Hole; Power Rating: 400mW; Case/Package: Conformal; Termination: Axial; Length: 3.6mm; Min Operating Temperature: -55°C; Resistor Type: Metal Film; Series: MRS16
R2#1 R4#1 R6#1 R8#1 R10#1 R12#1 R14#1 R16#1 R18 R20#1 R22#1 R24#1 R26#1 R28#1 R30#1 R33#1 R35#1 R37#1 R39#1 R41#1 = CMP-02408-000019-1: RES 1K OHM 0.4W 1% AXIAL; Max Power Dissipation: 400mW; Temperature Coefficient: 50ppm/°C; Resistance: 1kR; Technology: THIN FILM; Max Operating Temperature: 155°C; Number of Terminations: 2; RoHS Compliant: Yes; Packaging: Tape and Reel; Radiation Hardening: No; Contact Plating: Tin; Military Standard: Not; Construction: Cylindrical; Diameter: 1.6mm; Tolerance: 1%; Mount: Through Hole; Power Rating: 400mW; Case/Package: Conformal; Termination: Axial; Length: 3.6mm; Min Operating Temperature: -55°C; Resistor Type: Metal Film; Series: MRS16
R3#1 = CMP-02408-000019-1: RES 1K OHM 0.4W 1% AXIAL; Max Power Dissipation: 400mW; Temperature Coefficient: 50ppm/°C; Resistance: 330R; Technology: THIN FILM; Max Operating Temperature: 155°C; Number of Terminations: 2; RoHS Compliant: Yes; Packaging: Tape and Reel; Radiation Hardening: No; Contact Plating: Tin; Military Standard: Not; Construction: Cylindrical; Diameter: 1.6mm; Tolerance: 1%; Mount: Through Hole; Power Rating: 400mW; Case/Package: Conformal; Termination: Axial; Length: 3.6mm; Min Operating Temperature: -55°C; Resistor Type: Metal Film; Series: MRS16
R7#1 R11#1 R15#1 R19 R23#1 R27#1 R31#1 R36#1 R40#1 = CMP-02408-000019-1: RES 330 OHM 0.4W 1% AXIAL; Max Power Dissipation: 400mW; Temperature Coefficient: 50ppm/°C; Resistance: 330; Technology: THIN FILM; Max Operating Temperature: 155°C; Number of Terminations: 2; RoHS Compliant: Yes; Packaging: Tape and Reel; Radiation Hardening: No; Contact Plating: Tin; Military Standard: Not; Construction: Cylindrical; Diameter: 1.6mm; Tolerance: 1%; Mount: Through Hole; Power Rating: 400mW; Case/Package: Conformal; Termination: Axial; Length: 3.6mm; Min Operating Temperature: -55°C; Resistor Type: Metal Film; Series: MRS16

## Sheet clock.SchDoc
size A4; SheetNumber: 4; SheetTotal: 6
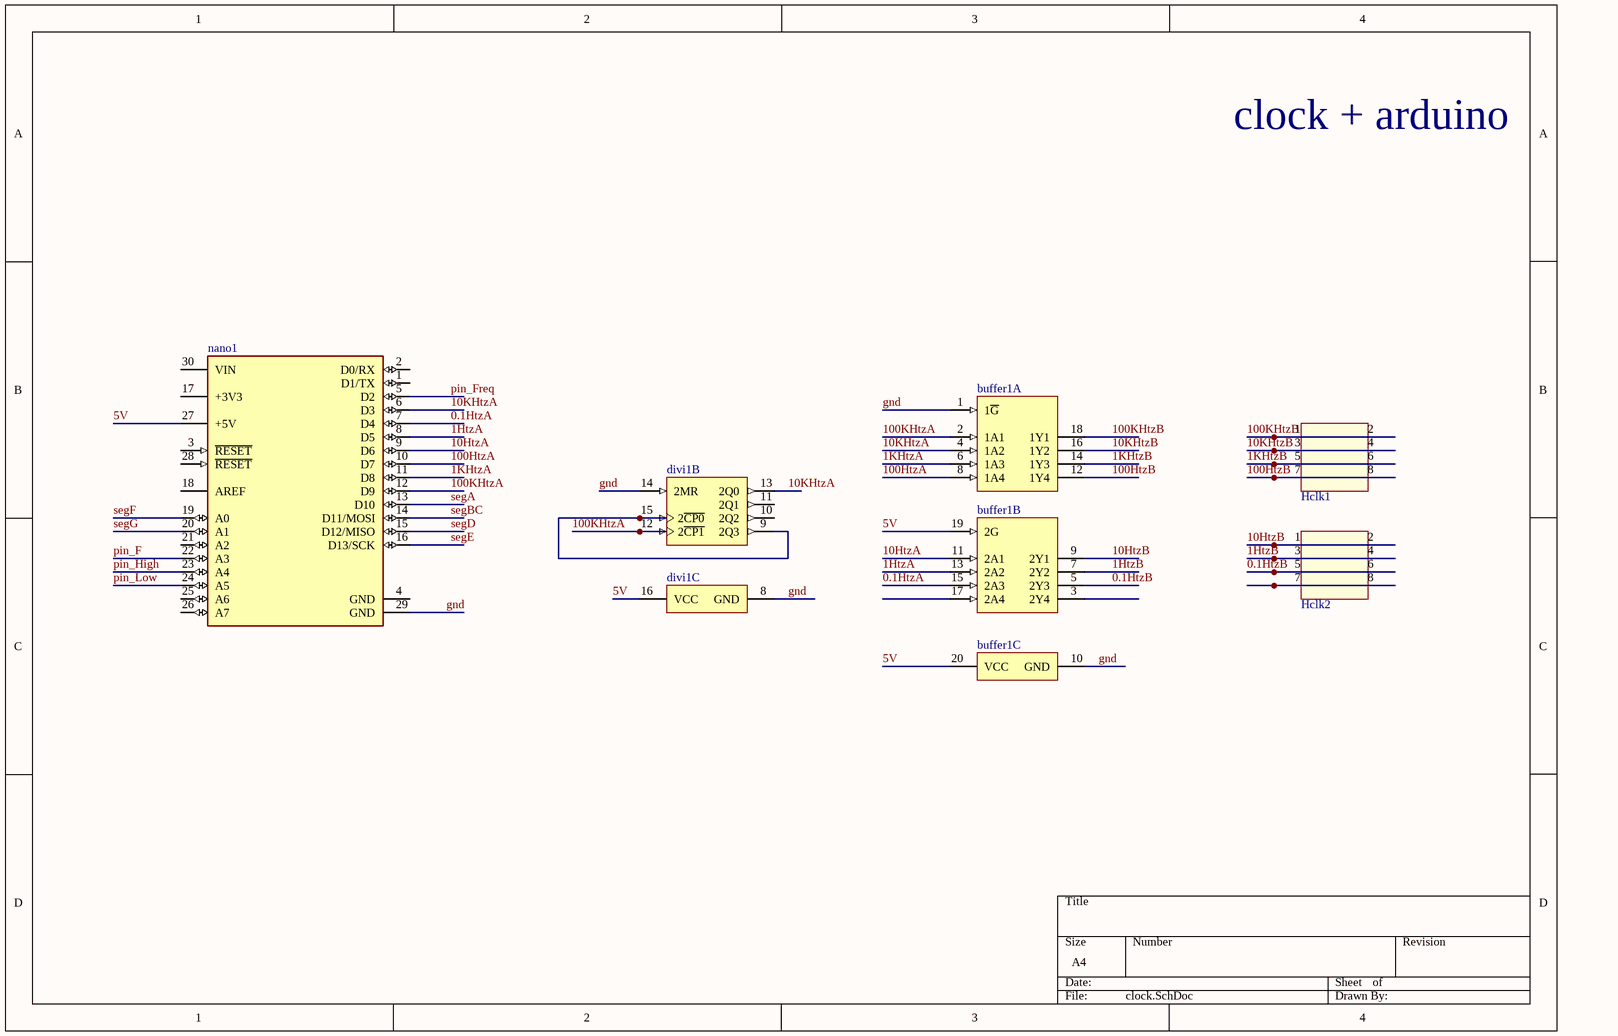
[diagram p4: clock.SchDoc]

### Parts
(Parts that share a designator on the sheet are numbered #1, #2 ... from top to bottom, then left to right.)
buffer1#1  SN74LS241N  [N0020A]  (value not drawn)  (parts A,B,C of 3)
divi1#1  CD74HC390E  [N0016A]  (value not drawn)  (parts B,C of 3)
Hclk1#1  header 2x4  [header 2x4]  (value not drawn)
Hclk2#1  header 2x4  [header 2x4]  (value not drawn)
nano1  A000005  [FP-A000005-MFG]  (value not drawn)

### Nets
0.1HtzA: buffer1#1.15(2A3) nano1.7(D4)
0.1HtzB: buffer1#1.5(2Y3) Hclk2#1.5 Hclk2#1.6
1HtzA: buffer1#1.13(2A2) nano1.8(D5)
1HtzB: buffer1#1.7(2Y2) Hclk2#1.3 Hclk2#1.4
1KHtzA: buffer1#1.6(1A3) nano1.11(D8)
1KHtzB: buffer1#1.14(1Y3) Hclk1#1.5 Hclk1#1.6
5V: buffer1#1.19(2G) buffer1#1.20(VCC) divi1#1.16(VCC) nano1.27(+5V)
10HtzA: buffer1#1.11(2A1) nano1.9(D6)
10HtzB: buffer1#1.9(2Y1) Hclk2#1.1 Hclk2#1.2
10KHtzA: buffer1#1.4(1A2) divi1#1.13(2Q0) nano1.6(D3)
10KHtzB: buffer1#1.16(1Y2) Hclk1#1.3 Hclk1#1.4
100HtzA: buffer1#1.8(1A4) nano1.10(D7)
100HtzB: buffer1#1.12(1Y4) Hclk1#1.7 Hclk1#1.8
100KHtzA: buffer1#1.2(1A1) divi1#1.12(2~{CP1}) nano1.12(D9)
100KHtzB: buffer1#1.18(1Y1) Hclk1#1.1 Hclk1#1.2
gnd: buffer1#1.1(1~{G}) buffer1#1.10(GND) divi1#1.8(GND) divi1#1.14(2MR) nano1.29(GND)
pin_F: nano1.22(A3)
pin_Freq: nano1.5(D2)
pin_High: nano1.23(A4)
pin_Low: nano1.24(A5)
segA: nano1.13(D10)
segBC: nano1.14(D11/MOSI)
segD: nano1.15(D12/MISO)
segE: nano1.16(D13/SCK)
segF: nano1.19(A0)
segG: nano1.20(A1)
Netdivi1#1_9: divi1#1.9(2Q3) divi1#1.15(2~{CP0})
NetHclk2#1_7: Hclk2#1.7 Hclk2#1.8

Not connected (* = marked no-connect by the designer): buffer1#1 3(2Y4) 17(2A4); divi1#1 10(2Q2) 11(2Q1); nano1 1(D1/TX) 2(D0/RX) 3(~{RESET}) 4(GND) 17(+3V3) 18(AREF) 21(A2) 25(A6) 26(A7) 28(~{RESET}) 30(VIN)

### Notes on the sheet
- clock + arduino

### Library data of the parts
buffer1#1 = CMP-0440-00144-3: Octal Buffers And Line Drivers With 3-State Outputs, N0020A, TUBE; Manufacturer: Texas Instruments; Voltage(Nom)(V): 5; Input Type: TTL; F @ Nom Voltage(Max)(Mhz): 35; tpd @ Nom Voltage(Max)(ns): 18; Bits(#): 8; VCC(Min)(V): 4.75; Rating: Catalog; VCC(Max)(V): 5.25; ICC @ Nom Voltage(Max)(mA): 0.046; Generic Part Number: SN74LS241; Code_JEDEC: MS-001; Operating Temperature Range(C): 0 to 70; PackageVersion: http://www.ti.com/lit/ml/mpdi002c/mpdi002c.pdf; PackageReference: N0020A; Output Type: TTL; DatasheetVersion: SDLS144C
divi1#1 = CMP-1623-00557-2: High Speed CMOS Logic Dual Decade Ripple Counters, N0016A, TUBE; Manufacturer: Texas Instruments; Technology Family: HC; ICC @ Nom Voltage(Max)(mA): 0.08; Inputs: 1; F @ Nom Voltage(Max)(Mhz): 28; tpd @ Nom Voltage(Max)(ns): 52; Bits(#): 4; Input Type: LVTTL/CMOS; Schmitt Trigger: No; Output Drive (IOL/IOH)(Max)(mA): 5.2/-5.2; VCC(Max)(V): 6; Rating: Catalog; VCC(Min)(V): 2; Voltage(Nom)(V): 3.3,5; Output Type: CMOS; Code_JEDEC: MS-001; Generic Part Number: CD74HC390; DatasheetVersion: SCHS185C; Function: Counter; Operating Temperature Range(C): -55 to 125; Type: Decade; PackageReference: N0016A
Hclk1#1 Hclk2#1 = header 2x4: header male 2x4; pin to pad: 1>C1 2>C2 3>C3 4>C4 5>C5 6>C6 7>C7 8>C8; Parameter 1: header 2x4
nano1 = CMP-189986-000002-1: ARDUINO NANO ATMEGA328 EVAL BRD; Number of Bits: 8; Evaluation Kit: Yes; Operating Supply Voltage: 12V; Interface: I2C; Data Bus Width: 8b; Core Architecture: AVR; Packaging: Bulk; Length: 7inch; Package Quantity: 50; Width: 5inch; REACH SVHC: No SVHC; Weight: 0.358383oz; Series: AVR® ATmega; Height: 0.25inch

## Sheet probe.SchDoc
size A4; SheetNumber: 6; SheetTotal: 7
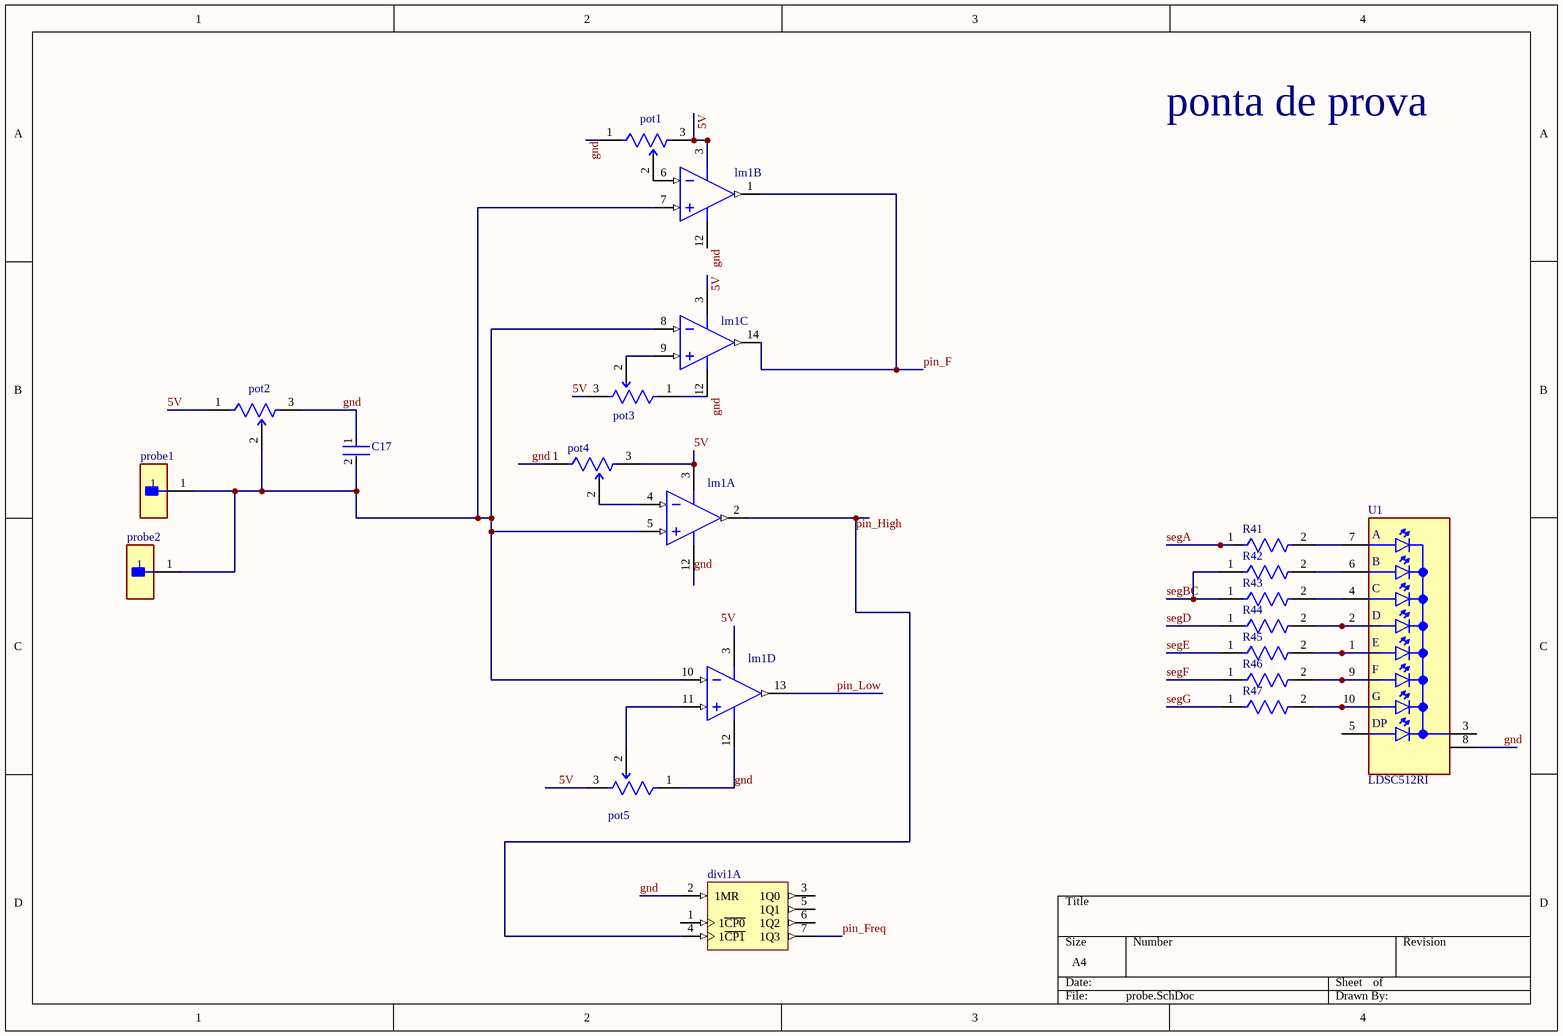
[diagram p5: probe.SchDoc]

### Parts
(Parts that share a designator on the sheet are numbered #1, #2 ... from top to bottom, then left to right.)
C17  RCER71H335K3K1H03B  [FP-RCE3M1-MFG]  (value not drawn)
divi1#1  CD74HC390E  [N0016A]  (value not drawn)  (part A of 3)
lm1#2  LM339J  [J0014A]  (value not drawn)  (parts A,B,C,D of 4)
pot1#2  3296W-1-501LF  [FP-3296W-MFG]  (value not drawn)
pot2#1  3296W-1-501LF  [FP-3296W-MFG]  (value not drawn)
pot3#1  3296W-1-501LF  [FP-3296W-MFG]  (value not drawn)
pot4#1  3296W-1-501LF  [FP-3296W-MFG]  (value not drawn)
pot5#1  3296W-1-501LF  [FP-3296W-MFG]  (value not drawn)
probe1  TSW-101-07-L-S  [FP-TSW-101-07-L-S-MFG]  (value not drawn)
probe2  TSW-101-07-L-S  [FP-TSW-101-07-L-S-MFG]  (value not drawn)
R41#2  MRS16000C2002FCT00  [FP-MRS1600-MFG]  (value not drawn)
R42#2  MRS16000C2002FCT00  [FP-MRS1600-MFG]  (value not drawn)
R43#2  MRS16000C2002FCT00  [FP-MRS1600-MFG]  (value not drawn)
R44#2  MRS16000C2002FCT00  [FP-MRS1600-MFG]  (value not drawn)
R45#2  MRS16000C2002FCT00  [FP-MRS1600-MFG]  (value not drawn)
R46#2  MRS16000C2002FCT00  [FP-MRS1600-MFG]  (value not drawn)
R47#2  MRS16000C2002FCT00  [FP-MRS1600-MFG]  (value not drawn)
U1  LDSC512RI  [LED_LDSC512RI]

### Nets
5V: lm1#2.3(V+) pot1#2.3(CW) pot2#1.1(CCW) pot3#1.3(CW) pot4#1.3(CW) pot5#1.3(CW)
gnd: C17.1 divi1#1.2(1MR) lm1#2.12(GND) pot1#2.1(CCW) pot2#1.3(CW) pot3#1.1(CCW) pot4#1.1(CCW) pot5#1.1(CCW) U1.8(CC)
pin_F: lm1#2.1(OUT2) lm1#2.14(OUT3)
pin_Freq: divi1#1.7(1Q3)
pin_High: divi1#1.4(1~{CP1}) lm1#2.2(OUT1)
pin_Low: lm1#2.13(OUT4)
segA: R41#2.1
segBC: R42#2.1 R43#2.1
segD: R44#2.1
segE: R45#2.1
segF: R46#2.1
segG: R47#2.1
NetC17_2: C17.2 lm1#2.5(IN1+) lm1#2.7(IN2+) lm1#2.8(IN3-) lm1#2.10(IN4-) pot2#1.2(WIPER) probe1.1 probe2.1
Netlm1#2_4: lm1#2.4(IN1-) pot4#1.2(WIPER)
Netlm1#2_6: lm1#2.6(IN2-) pot1#2.2(WIPER)
Netlm1#2_9: lm1#2.9(IN3+) pot3#1.2(WIPER)
Netlm1#2_11: lm1#2.11(IN4+) pot5#1.2(WIPER)
NetR41#2_2: R41#2.2 U1.7(A)
NetR42#2_2: R42#2.2 U1.6(B)
NetR43#2_2: R43#2.2 U1.4(C)
NetR44#2_2: R44#2.2 U1.2(D)
NetR45#2_2: R45#2.2 U1.1(E)
NetR46#2_2: R46#2.2 U1.9(F)
NetR47#2_2: R47#2.2 U1.10(G)

Not connected (* = marked no-connect by the designer): divi1#1 1(1~{CP0}) 3(1Q0) 5(1Q1) 6(1Q2); U1 3(CC) 5(DP)

### Notes on the sheet
- ponta de prova
- Labels drawn without touching a wire or pin: 5V

### Library data of the parts
C17 = CMP-06035-028451-1: as C13 on sheet chaves; Height: 5mm; Ratings: AEC-Q200; Capacitance: 3.3uF; Package Quantity: 500; Length: 0.217inch; Min Operating Temperature: -55°C; Voltage Rating (DC): 50V; Dielectric: X7R; Case/Package: Radial; Height - Seated (Max): 0.197inch; Termination: Radial; Mount: Through Hole; Max Operating Temperature: 125°C; Width: 0.157inch; Voltage Rating: 50V; Packaging: Bulk; Resistor Type: Ceramic; Tolerance: 10%; Lead Pitch: 0.197inch
divi1#1 = CMP-1623-00557-2: as divi1#1 on sheet clock; Output Type: CMOS; Code_JEDEC: MS-001; Generic Part Number: CD74HC390; DatasheetVersion: SCHS185C; Function: Counter; Operating Temperature Range(C): -55 to 125; Type: Decade; PackageReference: N0016A
lm1#2 = CMP-0060-00012-3: as lm1#1 on sheet leds; PackageDescription: Cerdip, .400 x .310in Body, 14 Lead, .300in Centers, .100in Pitch; ComponentLink1Description: Datasheet URL; PinCount: 14; PackageReference: J0014A; ComponentLink1URL: http://www.ti.com/general/docs/lit/getliterature.tsp?genericPartNumber=LM339-N&fileType=pdf; CompType: Comparator; RoHS: N
pot1#2 pot2#1 pot3#1 pot4#1 pot5#1 = CMP-07234-000046-1: TRIMMER 500 OHM 0.5W PC PIN TOP; Resistance: 500R; Temperature Coefficient: 100ppm/°C; Resistance Tolerance: 10%; Number of Turns: 25; Max Power Dissipation: 500mW; Packaging: Rail/Tube; Color: Blue; Technology: CERMET; Max Operating Temperature: 125°C; RoHS Compliant: Yes; Radiation Hardening: No; Series: 3296; Military Standard: Not; Width: 9.53mm; Weight: 0.03oz; Length: 9.53mm; Package Quantity: 50; Height: 0.395inch; Min Operating Temperature: -55°C; Lead Free: Lead Free; Mount: Through Hole; Depth: 4.83mm; Termination: Pin; Taper: Linear; Contact Plating: Tin; Resistor Type: Cermet; Tolerance: 10%; REACH SVHC: No SVHC; Power Rating: 500mW
probe1 probe2 = CMP-02766-001775-1: as pin_5V2#1 on sheet alimentacao; RoHS Compliant: Yes; Contact Finish - Mating: GOLD; Length: 2.54mm; Series: TSW; Insulation Material: PBT; Reach SVHC Compliant: Yes; Radiation Hardening: No; Contact Plating: Gold; Termination: Solder; Contact Type: Male Pin; Orientation: Straight; Number of Rows: 1; Depth: 2.54mm; Housing Material: Polyester; Lead Free: Lead Free; Fastening Type: Pull; Flammability Rating: UL94 V-0; Mount: Through Hole; Housing Color: Black; Contact Shape: Square; Min Operating Temperature: -55°C; Connector Type: Header; Contact Mating Length: 0.23inch; Width: 2.54mm; Packaging: Bulk; Contact Material: Bronze; Max Operating Temperature: 125°C; Number of Positions: 1; Color: Black; Insulation Color: Black
R41#2 R42#2 R43#2 R44#2 R45#2 R46#2 R47#2 = CMP-02408-000019-1: as R42#1 on sheet leds; Technology: THIN FILM; Max Operating Temperature: 155°C; Number of Terminations: 2; RoHS Compliant: Yes; Packaging: Tape and Reel; Radiation Hardening: No; Contact Plating: Tin; Military Standard: Not; Construction: Cylindrical; Diameter: 1.6mm; Tolerance: 1%; Mount: Through Hole; Power Rating: 400mW; Case/Package: Conformal; Termination: Axial; Length: 3.6mm; Min Operating Temperature: -55°C; Resistor Type: Metal Film; Series: MRS16
U1 = LDSC512RI: .56IN. 7 SEGMENT SINGLE DISPLAY, 565NM GREEN, GRAY FACE, WHITE SEGMENTS, COMMON | Lumex LDS-C512RI; SnapEDA_Link: https://www.snapeda.com/parts/LDS-C512RI/Lumex/view-part/?ref=snap; Package: None; Value: *; MF: Lumex; MP: LDS-C512RI; Check_prices: https://www.snapeda.com/parts/LDS-C512RI/Lumex/view-part/?ref=eda